# EAGLE schematic usb_if (EAGLE 9.6.0)
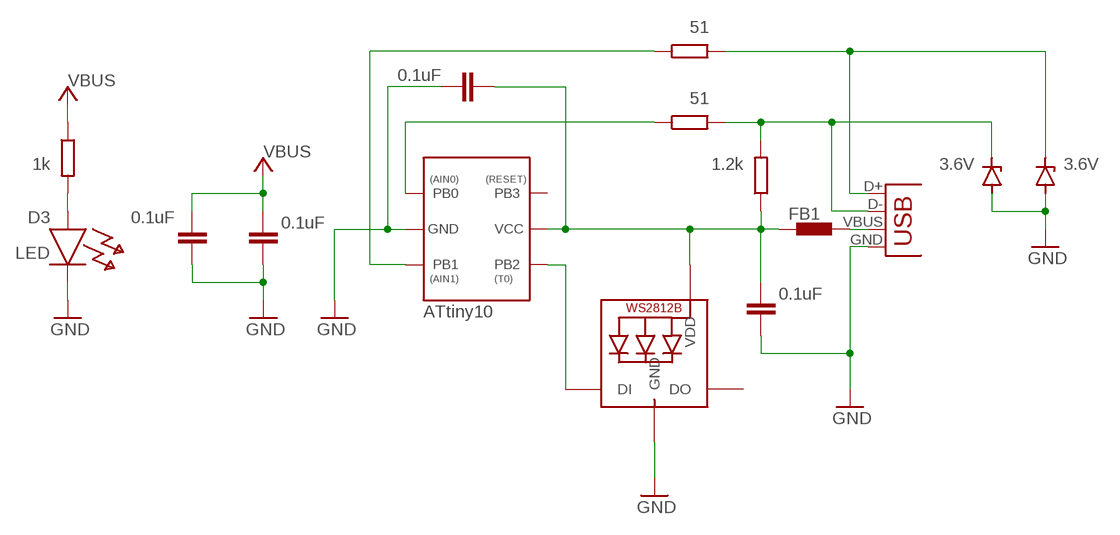
[diagram p0: schematic, sheet 1]
C1 (C): CAP: 0.1uF
C2 (C): CAP: 0.1uF
C3 (C): CAP: 0.1uF
C4 (C): CAP: 0.1uF
D1 (ZDIODE): V: 3.6V
D2 (ZDIODE): V: 3.6V
R1 (R): TAG: 51
R2 (R): VAL: 1k
R3 (R): TAG: 51
R4 (R): TAG: 1.2k

## Parts
D3  LED  (no package)
FB1  BLM15HB121SN1  [0402]
LED1  WS2812B3535  [LED3535]
U$1  ATTINY10_SOT23  [SOT23-6]
X1  USB-A-H  [USB-A-H]

## Nets
GND: D3.C LED1.4(GND) U$1.2(GND) X1.GND
N$1: D3.A
N$2: FB1.2 LED1.2(VDD) U$1.5(VCC)
N$3: U$1.3(PB1)
N$4: LED1.1(DI) U$1.4(PB2)
N$5: FB1.1 X1.VBUS
N$6: X1.D-
N$7: U$1.1(PB0)
N$8: X1.D+
Unconnected: LED1.3(DO) U$1.6(PB3(RESET))

## Library data of the parts
D3 = ngspice-simulation:LED: Diode
FB1 = inductors:BLM15H: EMIFIL (R) Chip Ferrite Bead for GHz Noise Source: http://www.murata.com/ Ferrite Bead BLM15H.pdf
LED1 = WS2812B:WS2812B; AVAILABILITY: Unavailable; DESCRIPTION: Raspberry Pi HAT (40 pin) Wheeled Robotics Kit; MF: SparkFun Electronics; MP: WS2812B; PACKAGE: None; PRICE: None
U$1 = attiny10_sot23:ATTINY10_SOT23
X1 = con-usb:USB: USB Connectors